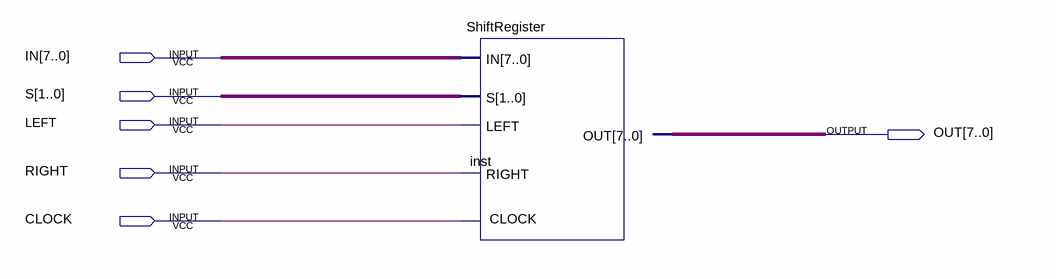
[diagram p0: schematic sheet]
// Quartus schematic ShiftRegister8BIT.bdf as structural Verilog: 1 symbols, 6 pins
module ShiftRegister8BIT (
  input  [7:0] IN,
  input  [1:0] S,
  input  LEFT,
  input  RIGHT,
  input  CLOCK,
  output [7:0] OUT
);

  ShiftRegister inst (.IN(IN), .S(S), .LEFT(LEFT), .RIGHT(RIGHT), .CLOCK(CLOCK), .OUT(OUT));
endmodule
